# Altium schematic sheet AMU-S29-V00-PDOCShutdownRelay.SchDoc
size A3; SheetNumber: 9; SheetTotal: 17
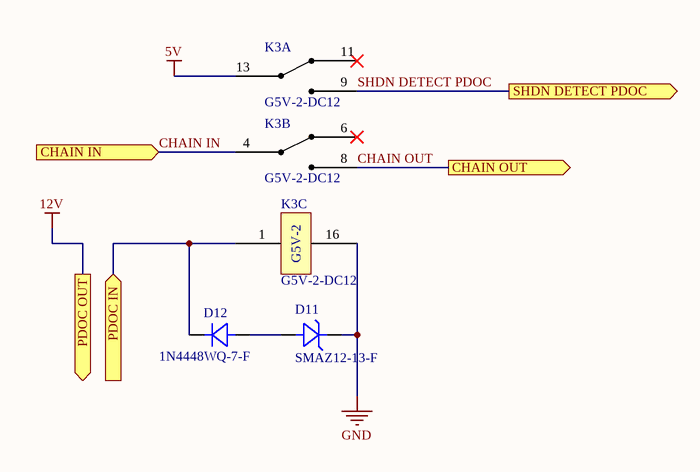
[diagram p0: AMU-S29-V00-PDOCShutdownRelay.SchDoc]

## Parts
D11  SMAZ12-13-F  [SMA]
D12  1N4448WQ-7-F  [SMA]
K3  G5V-2-DC12  [G5V-2]  (parts A,B,C of 3)

## Ports
CHAIN IN (in), CHAIN OUT (out), PDOC IN (in), PDOC OUT (out), SHDN DETECT PDOC (out)

## Nets
5V: K3.13
12V: port PDOC OUT
GND: D11.K(Cathode) K3.16
CHAIN IN: K3.4 ; port CHAIN IN
CHAIN OUT: K3.8 ; port CHAIN OUT
PDOC IN: D12.K(Cathode) K3.1 ; port PDOC IN
SHDN DETECT PDOC: K3.9 ; port SHDN DETECT PDOC
NetD11_A: D11.A(Anode) D12.A(Anode)

Not connected (* = marked no-connect by the designer): K3 6* 11*

## Notes on the sheet
- (in symbol G5V-2-DC12, part C) G5V-2

## Library data of the parts
D11 = SMAZ12-13-F: Zener Diode 12V 1W ±5% Surface Mount SMA; Manufacturer: ON Semiconductor; MPN: MM3Z56VB; ComponentLink1Description: Digikey; ComponentLink1URL: https://www.digikey.com.au/product-detail/en/diodes-incorporated/SMAZ12-13-F/SMAZ12-FDICT-ND/725073; ComponentLink2Description: Datasheet; ComponentLink2URL: https://www.diodes.com/assets/Datasheets/ds18015.pdf
D12 = 1N4448WQ-7-F: Diode, SMD, 75V, 5%, 250mA, SOD123; Manufacturer: ON Semiconductor / Fairchild; Manufacturer Part Number: 1N914BWS; Average Rectified Current: 150mA; Element Configuration: Single; Forward Voltage: 1V; Max Reverse Leakage Current: 5uA; Power Dissipation: 200mW; Recovery Time: 4ns; Max Forward Surge Current (Ifsm): 4A; Parameter 1: *; Weight: 0.0276g; Category: Rectifier Diodes; Contact Plating: Tin,Matte; Forward Current: 150mA; Lead Free: Lead Free; Max Operating Temperature: 150°C; Max Repetitive Reverse Voltage (Vrrm): 75V; Max Reverse Voltage (DC): 75V; Min Operating Temperature: -55°C; Mount: Surface Mount; Number of Pins: 2; Package Quantity: 1; Packaging: Tape and Reel; Peak Reverse Current: 5uA; Radiation Hardening: No; REACH SVHC: No SVHC; Reverse Recovery Time: 4ns; Height: 1mm; Length: 1.8mm; Reverse Voltage: 75V; Width: 1.35mm
K3 = G5V-2-DC12: General Purpose Relay DPDT (2 Form C) Through Hole, 12V, 2A